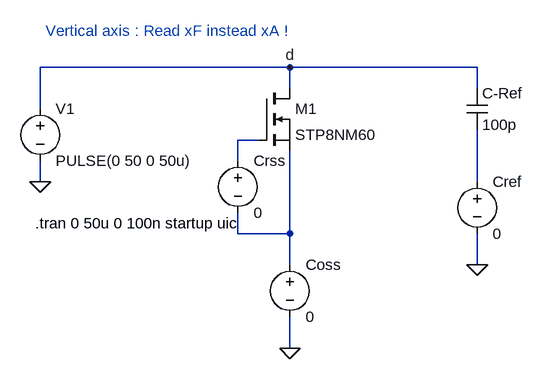
[diagram p0: schematic Crss_Coss_againstVds.asc]
Crss_Coss_againstVds.asc, the LTspice schematic file:
Version 4
SHEET 1 1480 680
WIRE 416 -224 32 -224
WIRE 704 -224 416 -224
WIRE 416 -192 416 -224
WIRE 704 -192 704 -224
WIRE 32 -160 32 -224
WIRE 368 -112 336 -112
WIRE 336 -80 336 -112
WIRE 32 -48 32 -80
WIRE 704 -48 704 -128
WIRE 336 32 336 0
WIRE 416 32 416 -96
WIRE 416 32 336 32
WIRE 416 80 416 32
WIRE 704 80 704 32
WIRE 416 208 416 160
FLAG 32 -48 0
FLAG 416 208 0
FLAG 704 80 0
FLAG 416 -224 d
SYMBOL voltage 32 -176 R0
WINDOW 123 0 0 Left 0
WINDOW 39 0 0 Left 0
SYMATTR InstName V1
SYMATTR Value PULSE(0 50 0 50u)
SYMBOL voltage 704 -64 R0
SYMATTR InstName Cref
SYMATTR Value 0
SYMBOL cap 688 -192 R0
SYMATTR InstName C-Ref
SYMATTR Value 100p
SYMBOL voltage 416 64 R0
SYMATTR InstName Coss
SYMATTR Value 0
SYMBOL voltage 336 -96 R0
SYMATTR InstName Crss
SYMATTR Value 0
SYMBOL nmos 368 -192 R0
SYMATTR InstName M1
SYMATTR Value STP8NM60
TEXT 24 16 Left 0 !.tran 0 50u 0 100n startup uic
TEXT 40 -280 Left 0 ;Vertical axis : Read xF instead xA !

The netlist it stands for:
* Crss_Coss_againstVds.asc
V1 d 0 PULSE(0 50 0 50u)
V§Cref N002 0 0
C-Ref d N002 100p
V§Coss N003 0 0
V§Crss N001 N003 0
M1 d N001 N003 N003 STP8NM60
.model NMOS NMOS
.model PMOS PMOS
.lib standard.mos
.tran 0 50u 0 100n startup uic
* Vertical axis : Read xF instead xA !
.backanno
.end